# Altium schematic sheet STM32F4 Control Board.SchDoc
size 599 x 190 mm; SheetNumber: 1; SheetTotal: 1
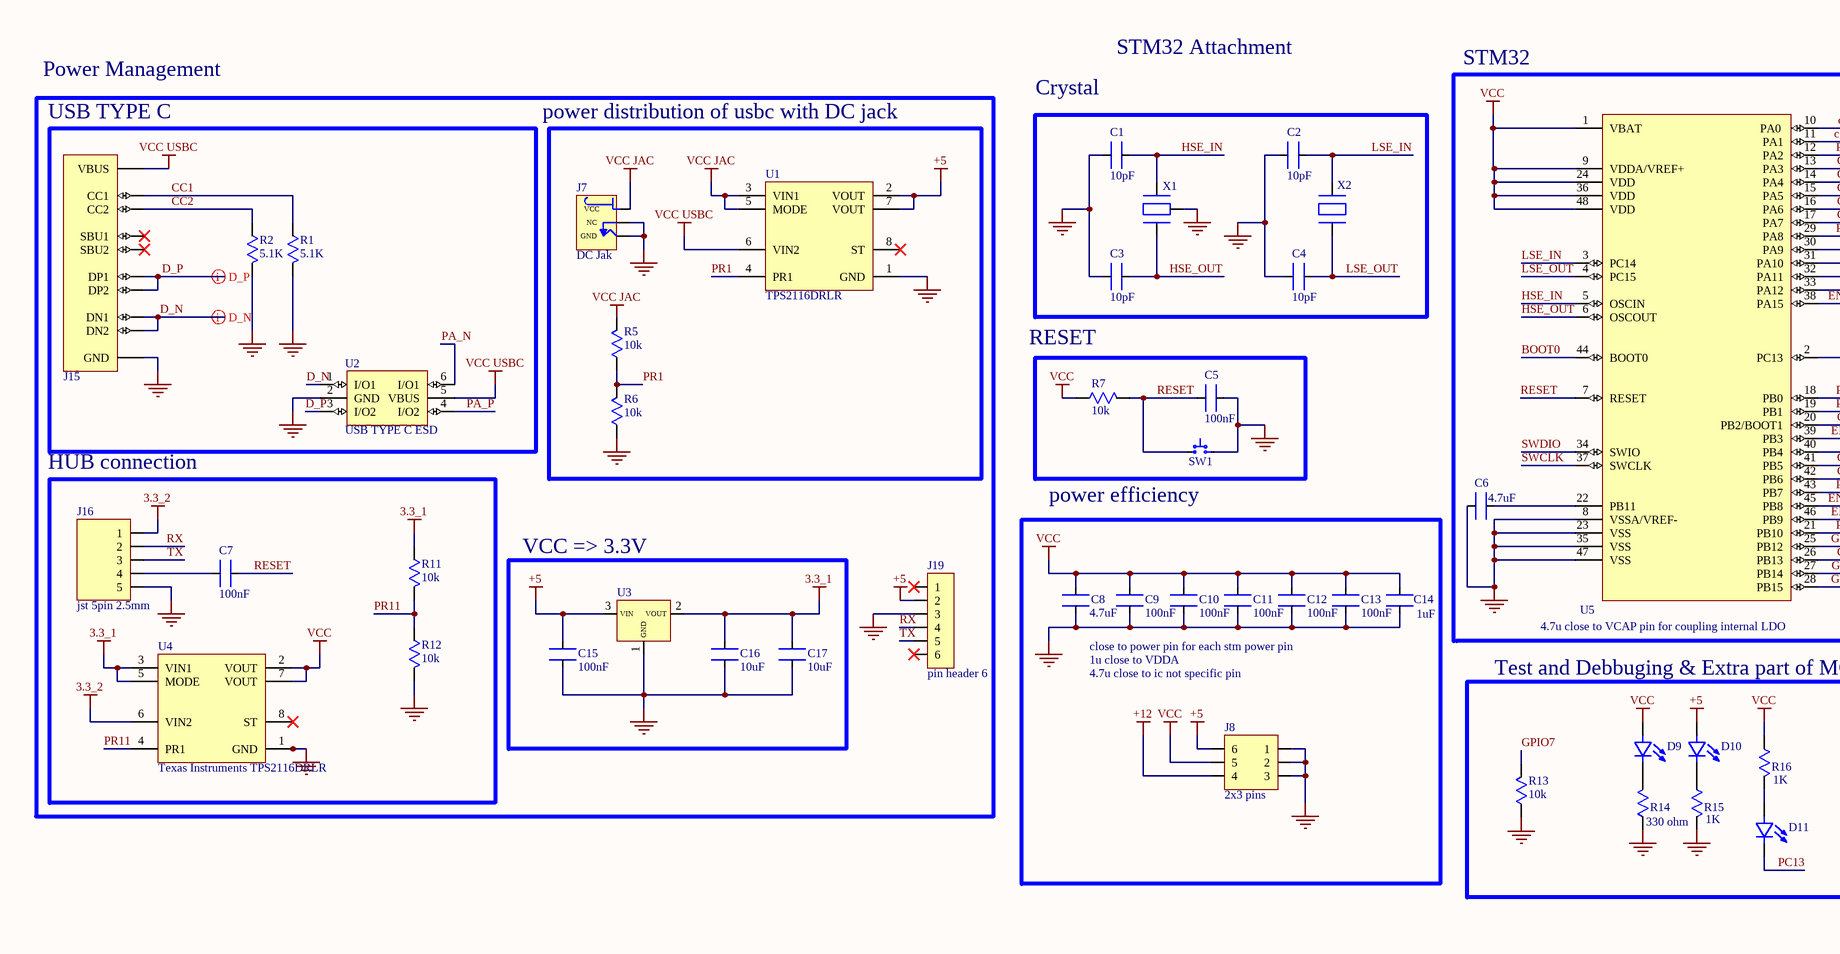
[diagram p0: STM32F4 Control Board.SchDoc, left]
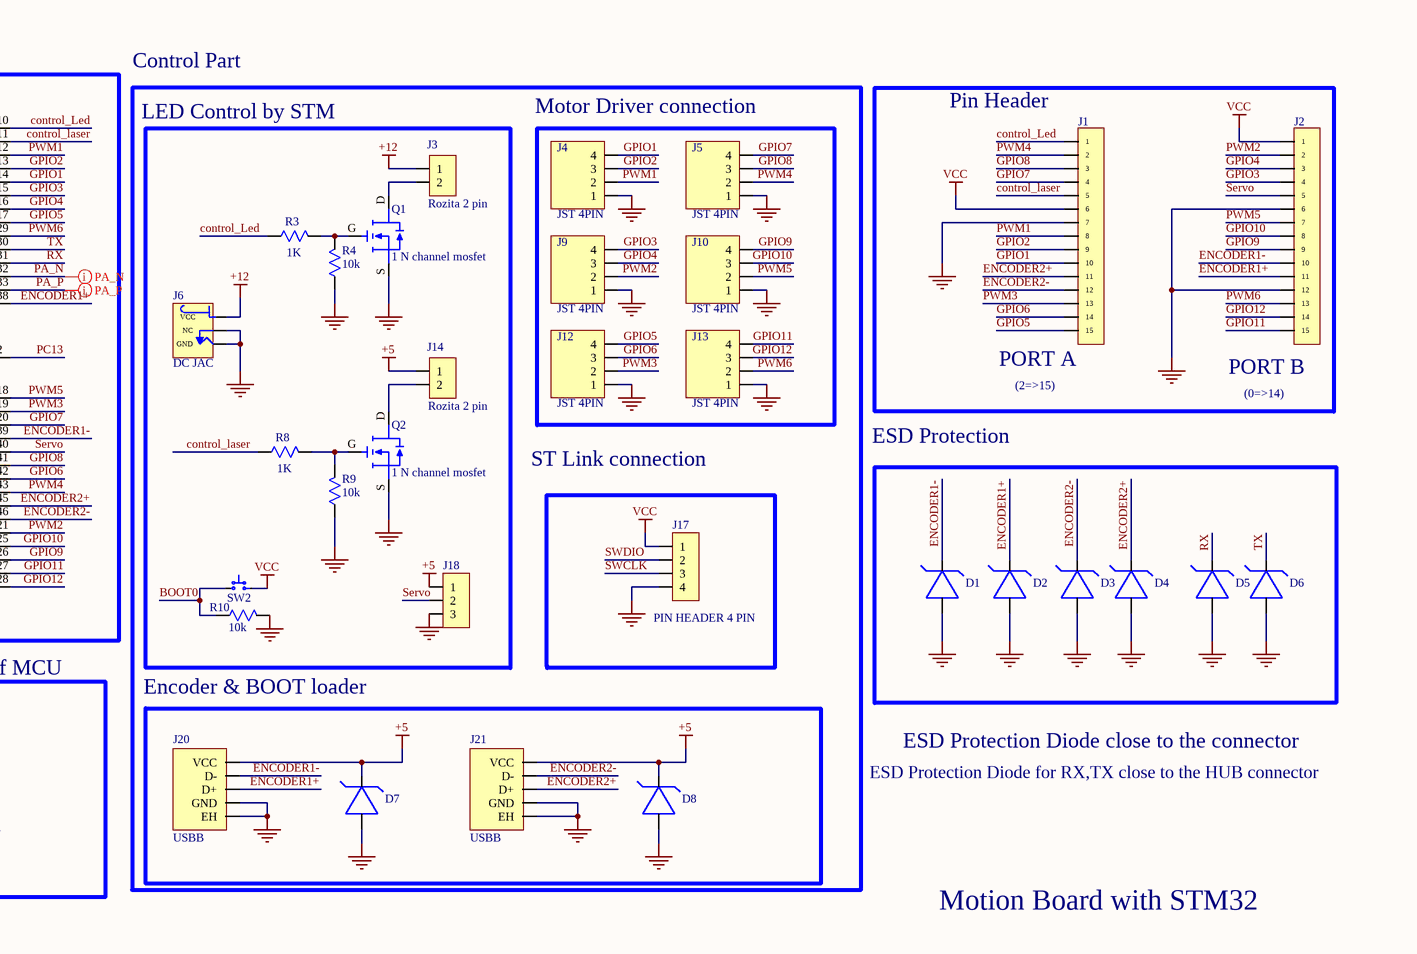
[diagram p1: STM32F4 Control Board.SchDoc, right]

## Parts
C1  10pF  [0603 CAP]
C2  10pF  [0603 CAP]
C3  10pF  [0603 CAP]
C4  10pF  [0603 CAP]
C5  100nF  [0603 CAP]
C6  4.7uF  [0603 CAP]
C7  100nF  [0603 CAP]
C8  4.7uF  [0603 CAP]
C9  100nF  [0603 CAP]
C10  100nF  [0603 CAP]
C11  100nF  [0603 CAP]
C12  100nF  [0603 CAP]
C13  100nF  [0603 CAP]
C14  1uF  [0603 CAP]
C15  100nF  [0603 CAP]
C16  10uF  [0603 CAP]
C17  10uF  [0603 CAP]
D1  ESD protection diode  [ESD protection diode]  (value not drawn)
D2  ESD protection diode  [ESD protection diode]  (value not drawn)
D3  ESD protection diode  [ESD protection diode]  (value not drawn)
D4  ESD protection diode  [ESD protection diode]  (value not drawn)
D5  ESD protection diode  [ESD protection diode]  (value not drawn)
D6  ESD protection diode  [ESD protection diode]  (value not drawn)
D7  ESD protection diode  [ESD protection diode]  (value not drawn)
D8  ESD protection diode  [ESD protection diode]  (value not drawn)
D9  RED led  [led 0805]  (value not drawn)
D10  RED led  [led 0805]  (value not drawn)
D11  RED led  [led 0805]  (value not drawn)
J1  pin header 15 pin  [pin headers 15 pin]  (value not drawn)
J2  pin header 15 pin  [pin headers 15 pin]  (value not drawn)
J3  Rozita 2 pin  [Rozita]
J4  JST 4PIN  [JST 4PIN]
J5  JST 4PIN  [JST 4PIN]
J6  DC JAC  [DC Jack]
J7  DC Jak  [DC Jack]
J8  2x3 pins  [2x3 pins]
J9  JST 4PIN  [JST 4PIN]
J10  JST 4PIN  [JST 4PIN]
J12  JST 4PIN  [JST 4PIN]
J13  JST 4PIN  [JST 4PIN]
J14  Rozita 2 pin  [Rozita]
J15  USB TYPE-C-31-M-12  [USB Type-C]  (value not drawn)
J16  jst 5pin 2.5mm  [JST 5 PIN 2.5 MM]
J17  PIN HEADER 4 PIN  [pin header 4PIN]
J18  Plugin,P=2.54mm  [pin header 3 pin]  (value not drawn)
J19  pin header 6  [pin header 6 pin]
J20  USBB  [USBB]
J21  USBB  [USBB]
Q1  1 N channel mosfet  [1 N channel mosfet]
Q2  1 N channel mosfet  [1 N channel mosfet]
R1  5.1K  [0603 RES]
R2  5.1K  [0603 RES]
R3  1K  [0603 RES]
R4  10k  [0603 RES]
R5  10k  [0603 RES]
R6  10k  [0603 RES]
R7  10k  [0603 RES]
R8  1K  [0603 RES]
R9  10k  [0603 RES]
R10  10k  [0603 RES]
R11  10k  [0603 RES]
R12  10k  [0603 RES]
R13  10k  [0603 RES]
R14  330 ohm  [0603 RES]
R15  1K  [0603 RES]
R16  1K  [0603 RES]
SW1  push button  [Push button]  (value not drawn)
SW2  push button  [Push button]  (value not drawn)
U1  TPS2116DRLR  [power distribution]
U2  USB TYPE C ESD  [usb c esd]
U3  ST LDO 3.3 regulator  [ST_LDO]  (value not drawn)
U4  Texas Instruments TPS2116DRLR  [power distribution]
U5  High-performance basic series ARM Cortex-M4 MCU with DSP and FPU, featuring 512 KB Flash, 100 MHz CPU, and ART accelerator  [Stm32 UFQFPN-48]  (value not drawn)
X1  Shenzhen SCTF Elec SX3B25.000F0810G30  [25MHZ Crystal Oscillators]  (value not drawn)
X2  Seiko Epson X1A0000610006  [32.768 KHZ Crystal oscillator]  (value not drawn)

## Blocks framed on the sheet
STM32: C6 U5
Crystal: C1-C4 X1 X2
USB TYPE C: J15 R1 R2 U2
Motor Driver connection: J4 J5 J9 J10 J12 J13
HUB connection: C7 J16 R11 R12 U4
power efficiency: C8-C14 J8
VCC => 3.3V: C15-C17 U3
Test and Debbuging & Extra part of MCU: D9-D11 R13-R16
Encoder & BOOT loader: D7 D8 J20 J21

## Nets
3.3_1: C16.1 C17.1 R11.2 U3.2(VOUT) U4.3(VIN1) U4.5(MODE)
3.3_2: J16.1 U4.6(VIN2)
+5: C15.2 D7.2 D8.2 D10.1 J8.6 J14.1 J18.1 J19.2 J20.1(VCC) J21.1(VCC) U1.2(VOUT) U1.7(VOUT) U3.3(VIN)
+12: J3.1 J6.1(VCC) J8.4
GND: C1.2 C2.2 C3.2 C4.2 C5.1 C6.2 C8.1 C9.2 C10.2 C11.2 C12.2 C13.2 C14.2 C15.1 C16.2 C17.2 D1.1 D2.1 D3.1 D4.1 D5.1 D6.1 D7.1 D8.1 J1.7 J2.6 J2.12 J4.1 J5.1 J6.2(GND) J6.3(NC) J7.2(GND) J7.3(NC) J8.1 J8.2 J8.3 J9.1 J10.1 J12.1 J13.1 J15.0(GND) J16.5 J17.4 J18.3 J19.3 J20.4(GND) J20.5(EH) J21.4(GND) J21.5(EH) Q1.S Q2.S R1.2 R2.2 R4.1 R6.1 R9.1 R10.2 R12.1 R13.1 R14.1 R15.2 SW1.2 U1.1(GND) U2.2(GND) U3.1(GND) U4.1(GND) U5.8(VSSA/VREF-) U5.23(VSS) U5.35(VSS) U5.47(VSS) X1.2(GND)
VCC: C8.2 C9.1 C10.1 C11.1 C12.1 C13.1 C14.1 D9.1 J1.6 J2.1 J8.5 J17.1 R7.1 R16.1 SW2.2 U4.2(VOUT) U4.7(VOUT) U5.1(VBAT) U5.9(VDDA/VREF+) U5.24(VDD) U5.36(VDD) U5.48(VDD)
VCC JAC: J7.1(VCC) R5.2 U1.3(VIN1) U1.5(MODE)
VCC USBC: J15.VBUS U1.6(VIN2) U2.5(VBUS)
BOOT0: R10.1 SW2.1 U5.44(BOOT0)
CC1: J15.A5(CC1) R1.1
CC2: J15.B5(CC2) R2.1
control_laser: J1.5 R8.1 U5.11(PA1)
control_Led: J1.1 R3.1 U5.10(PA0)
D_N: J15.A7(DN1) J15.B7(DN2) U2.1(I/O1)
D_P: J15.A6(DP1) J15.B6(DP2) U2.3(I/O2)
ENCODER1+: D2.2 J2.11 J20.3(D+) U5.38(PA15)
ENCODER1-: D1.2 J2.10 J20.2(D-) U5.39(PB3)
ENCODER2+: D4.2 J1.11 J21.3(D+) U5.45(PB8)
ENCODER2-: D3.2 J1.12 J21.2(D-) U5.46(PB9)
GPIO1: J1.10 J4.4 U5.14(PA4)
GPIO2: J1.9 J4.3 U5.13(PA3)
GPIO3: J2.4 J9.4 U5.15(PA5)
GPIO4: J2.3 J9.3 U5.16(PA6)
GPIO5: J1.15 J12.4 U5.17(PA7)
GPIO6: J1.14 J12.3 U5.42(PB6)
GPIO7: J1.4 J5.4 R13.2 U5.20(PB2/BOOT1)
GPIO8: J1.3 J5.3 U5.41(PB5)
GPIO9: J2.9 J10.4 U5.26(PB13)
GPIO10: J2.8 J10.3 U5.25(PB12)
GPIO11: J2.15 J13.4 U5.27(PB14)
GPIO12: J2.14 J13.3 U5.28(PB15)
HSE_IN: C1.1 U5.5(OSCIN) X1.1(OSC1)
HSE_OUT: C3.1 U5.6(OSCOUT) X1.3(OSC2)
LSE_IN: C2.1 U5.3(PC14) X2.1(OSC1)
LSE_OUT: C4.1 U5.4(PC15) X2.2(OSC2)
PA_N: U2.6(I/O1) U5.32(PA11)
PA_P: U2.4(I/O2) U5.33(PA12)
PC13: D11.2 U5.2(PC13)
PR1: R5.1 R6.2 U1.4(PR1)
PR11: R11.1 R12.2 U4.4(PR1)
PWM1: J1.8 J4.2 U5.12(PA2)
PWM2: J2.2 J9.2 U5.21(PB10)
PWM3: J1.13 J12.2 U5.19(PB1)
PWM4: J1.2 J5.2 U5.43(PB7)
PWM5: J2.7 J10.2 U5.18(PB0)
PWM6: J2.13 J13.2 U5.29(PA8)
RESET: C5.2 C7.2 R7.2 SW1.1 U5.7(RESET)
RX: D5.2 J16.2 J19.4 U5.31(PA10)
Servo: J2.5 J18.2 U5.40(PB4)
SWCLK: J17.3 U5.37(SWCLK)
SWDIO: J17.2 U5.34(SWIO)
TX: D6.2 J16.3 J19.5 U5.30(PA9)
NetC6_1: C6.1 U5.22(PB11)
NetC7_1: C7.1 J16.4
NetD9_2: D9.2 R14.2
NetD10_2: D10.2 R15.1
NetD11_1: D11.1 R16.2
NetJ3_2: J3.2 Q1.D
NetJ14_2: J14.2 Q2.D
NetQ1_G: Q1.G R3.2 R4.2
NetQ2_G: Q2.G R8.2 R9.2

Not connected (* = marked no-connect by the designer): J15 A8(SBU1)* B8(SBU2)*; J19 1* 6*; U1 8(ST)*; U4 8(ST)*

## Layout directives
differential pair: D_N, D_P, PA_N, PA_P

## Notes on the sheet
- Power Management
- STM32 Attachment
- Control Part
- power distribution of usbc with DC jack
- LED Control by STM
- (near J1) Pin Header
- RESET
- (near J1) PORT A
- (2=>15)
- (near J2) PORT B
- (0=>14)
- ST Link connection
- ESD Protection
- (near U5) 4.7u close to VCAP pin for coupling internal LDO
- close to power pin for each stm power pin
- 1u close to VDDA
- 4.7u close to ic not specific pin
- ESD Protection Diode close to the connector
- ESD Protection Diode for RX,TX close to the HUB connector
- Motion Board with STM32

## Library data of the parts
C1-C4 = 10pf: 50V 10pF NP0 ±5% 0603 Multilayer Ceramic Capacitors MLCC - SMD/SMT ROHS; Manufacture: YAGEO; Manufacture part number: CC0603JRNPO9BN100; Supplier: LCSC; Supplier part number: C106245; Link: https://www.lcsc.com/product-detail/Multilayer-Ceramic-Capacitors-MLCC-SMD-SMT_YAGEO-CC0603JRNPO9BN100_C106245.html
C5 C7 C9-C13 C15 = 100nF: 50V 100nF X7R ±10% 0603 Multilayer Ceramic Capacitors MLCC - SMD/SMT ROHS; Manufacture: YAGEO; Manufacture part number: CC0603KRX7R9BB104; Supplier: LCSC; Supplier part number: C14663; Link: https://www.lcsc.com/product-detail/Multilayer-Ceramic-Capacitors-MLCC-SMD-SMT_YAGEO-CC0603KRX7R9BB104_C14663.html
C6 C8 = 4.7uF: 6.3V 4.7uF X5R ±20% 0603 Multilayer Ceramic Capacitors MLCC - SMD/SMT ROHS; Manufacture: Samsung Electro-Mechanics; Manufacture part number: CL10A475MQ8NNNC; Supplier: LCSC; Supplier part number: C154959; Link: https://www.lcsc.com/product-detail/Multilayer-Ceramic-Capacitors-MLCC-SMD-SMT_Samsung-Electro-Mechanics-CL10A475MQ8NNNC_C154959.html?s_z=n_6.3V%25204.7uF%2520X5R%2520%25C2%25B120%2525%25200603%2520Multilayer%2520Ceramic%2520Capacitors%2520MLCC%2520-%2520SMD%252FSMT%2520ROHS
C14 = 1uF: 16V 1uF X5R ±10% 0603 Multilayer Ceramic Capacitors MLCC - SMD/SMT ROHS; Manufacture: HRE; Manufacture part number: CGA0603X5R105K160JT; Supplier: LCSC; Supplier part number: C6119849; Link: https://www.lcsc.com/product-detail/Multilayer-Ceramic-Capacitors-MLCC-SMD-SMT_HRE-CGA0603X5R105K160JT_C6119849.html
C16 C17 = 10uF: 6.3V 10uF X5R ±20% 0603 Multilayer Ceramic Capacitors MLCC - SMD/SMT ROHS; Manufacture: YAGEO; Manufacture part number: CC0603MRX5R5BB106; Supplier: LCSC; Supplier part number: C109454; Link: https://www.lcsc.com/product-detail/Multilayer-Ceramic-Capacitors-MLCC-SMD-SMT_YAGEO-CC0603MRX5R5BB106_C109454.html
D1-D8 = ESD protection diode: SOT-5X3 ESD and Surge Protection (TVS/ESD) ROHS; Manufacture: Texas Instruments; Manufacture part number: ESD321DYAR; Supplier: LCSC; Supplier part number: C20345394; Link: https://www.lcsc.com/product-detail/ESD-and-Surge-Protection-TVS-ESD_Texas-Instruments-ESD321DYAR_C20345394.html
D9-D11 = RED LED: 20mA 8mcd Colorless Transparent Lens 617nm Red 2V 0805 LED Indication - Discrete ROHS; Manufacture: Kingbright; Manufacture part number: APT2012EC; Supplier: LCSC; Supplier part number: C5879378; Link: https://www.lcsc.com/product-detail/LED-Indication-Discrete_Kingbright-APT2012EC_C5879378.html
J1 J2 = pin header 15 pin: Gold 1kV 3A Straight Policy 2.5mm 6mm 15P -40℃~+105℃ 3mm 2.54mm Brass Black Single Row 1x15P Plugin,P=2.54mm Pin Headers ROHS; Manufacture: Megastar; Manufacture part number: ZX-PZ2.54-1-15PZZ; Supplier: LCSC; Supplier part number: C7501269; Link: https://www.lcsc.com/product-detail/Pin-Headers_Megastar-ZX-PZ2-54-1-15PZZ_C7501269.html?s_z=n_pin%2520hea
J3 J14 = Rozita 2 pin: 1x2P 18A -40℃~+105℃ 250V Green 12~30 Direct Insert 5.08mm 2.5 1 2 Plugin,P=5.08mm Screw Terminal Blocks ROHS; Manufacture: DORABO; Manufacture part number: DB128L-5.08-2P-GN-S; Supplier: LCSC; Supplier part number: C395868; Link: https://www.lcsc.com/product-detail/Screw-Terminal-Blocks_DORABO-DB128L-5-08-2P-GN-S_C395868.html
J4 J5 J9 J10 J12 J13 = JST 4PIN: 1x4P 4P XH Tin 4 -25℃~+85℃ 3A 1 2.5mm Copper Direct Insert Plugin,P=2.5mm Wire To Board Connector ROHS; Manufacture: Hong Cheng; Manufacture part number: HC-XH-4A-TW; Supplier: LCSC; Supplier part number: C19273766; Link: https://www.lcsc.com/product-detail/Wire-To-Board-Connector_Hong-Cheng-HC-XH-4A-TW_C19273766.html?s_z=n_C19273766
J6 J7 = DC Jak: Bend-in DC Power Receptacle -20℃~+70℃ 2.5mm 6.5mm 5A 24V Plugin DC Power Connectors ROHS; Manufacture: XKB Connection; Manufacture part number: DC-005-5A-2.5; Supplier: LCSC; Supplier part number: C381115; Link: https://www.lcsc.com/product-detail/DC-Power-Connectors_XKB-Connection-DC-005-5A-2-5_C381115.html?s_z=n_DC%2520Power%2520Receptacle%25202.5mm%25206.4mm%25205A%2520%2520Plugin%2520DC%2520Power%2520Connectors%2520ROHS
J8 = 2x3 pins: Straight 2.54mm 6mm 6P 3mm 2.54mm 双排 2x3P Plugin,P=2.54mm Pin Headers ROHS; Manufacturer: HanElectricity; Mfr. Part #: 2541WV-2x03P; supplier: LCSC; LCSC Part #: C5383104
J15 = USB TYPE-C-31-M-12: 5A 1 16P Female Type-C SMD USB Connectors ROHS; Manufacture: Korean Hroparts Elec; Supplier: LCSC; Supplier part number: C165948; Manufacture part number: TYPE-C-31-M-12; Link: https://www.lcsc.com/product-detail/USB-Connectors_Korean-Hroparts-Elec-TYPE-C-31-M-12_C165948.html
J16 = jst 5pin 2.5mm: 1x5P 5P XH Tin 5 -25℃~+85℃ 3A 1 2.5mm Brass Direct Insert Plugin,P=2.5mm Wire To Board Connector ROHS; Manufacture part number: B5B-XH-A(LF)(SN); Supplier: LCSC; Supplier part number: C157991; Manufacture: JST; Link: https://www.lcsc.com/product-detail/Wire-To-Board-Connector_JST-B5B-XH-A-LF-SN_C157991.html
J17 = PIN HEADER 4 PIN: 3A Policy 2.5mm 6mm 4P -40℃~+105℃ 2.54mm Single Row 1x4P Plugin,P=2.54mm Pin Headers ROHS; Manufacture: BXCONN; Manufacture part number: A254UP-ZD04P; Supplier: LCSC; Supplier part number: C41413833; Link: https://www.lcsc.com/product-detail/Pin-Headers_BXCONN-A254UP-ZD04P_C41413833.html
J18 = Pin Header 3pin: 3A Straight 3P -65℃~+125℃ 2.54mm Black Single Row Phosphor Bronze Plugin,P=2.54mm Pin Headers ROHS; Manufacture: Amphenol ICC; Manufacture part number: 68001-203HLF; Supplier: LCSC; Supplier part number: C5346215; Link: https://www.lcsc.com/product-detail/Pin-Headers_Amphenol-ICC-68001-203HLF_C5346215.html?s_z=n_Pin%2520Header%25201x3%2520TH%2520Pitch%25202.54mm
J19 = pin header 6: Straight Policy 2.5mm 6P 6mm -40℃~+105℃ 3mm 2.54mm Single Row Black Brass 1x6P Plugin,P=2.54mm Pin Headers ROHS; Manufacture: XFCN; Manufacture part number: PZ254V-11-06P; Supplier: LCSC; Supplier part number: C492405; Link: https://www.lcsc.com/product-detail/Pin-Headers_XFCN-PZ254V-11-06P_C492405.html?s_z=n_Connectors%257CPin%2520Headers
J20 J21 = USBB R04P-F000: USB 2.0 1 4P Female Type-B Plugin USB Connectors ROHS; Manufacture: Ckmtw(Shenzhen Cankemeng); Manufacture part number: U-USBBR04P-F000; Supplier: lcsc; Supplier part number: C189733; Link: https://www.lcsc.com/product-detail/USB-Connectors_Ckmtw-Shenzhen-Cankemeng-U-USBBR04P-F000_C189733.html?s_z=n_usbb
Q1 Q2 = 1 N channel mosfet: 20V 7A 1.25W 10mΩ@4.5V,7A 500mV 1 N-channel SOT-23-3L MOSFETs ROHS; Manufacture: Siliup; Manufacture part number: SP20N09T1; Supplier: LCSC; Supplier part number: C41354900; Link: https://www.lcsc.com/product-detail/MOSFETs_Siliup-SP20N09T1_C41354900.html
R1 R2 = RES 5.1 K: 100mW Thin Film Resistor 75V ±25ppm/℃ ±0.1% 5.1kΩ 0603 Chip Resistor - Surface Mount ROHS; Manufacture: YAGEO; Manufacture part number: RT0603BRD075K1L; Supplier: LCSC; Supplier part number: C122969; Link: https://www.lcsc.com/product-detail/Chip-Resistor-Surface-Mount_YAGEO-RT0603BRD075K1L_C122969.html
R3 R8 R15 R16 = RES 1K ohm: 100mW Thick Film Resistors 75V ±100ppm/℃ ±5% 1kΩ 0603 Chip Resistor - Surface Mount ROHS; Manufacture: FOJAN; Manufacture part number: FRC0603J102 TS; Supplier: LCSC; Supplier part number: C2907113; Link: https://www.lcsc.com/product-detail/Chip-Resistor-Surface-Mount_FOJAN-FRC0603J102-TS_C2907113.html
R4-R7 R9-R13 = RES 10kohm: 100mW Thin Film Resistor 75V ±25ppm/℃ ±0.1% 10kΩ 0603 Chip Resistor - Surface Mount ROHS; Manufacture: YAGEO; Manufacture part number: RT0603BRD0710KL; Supplier: LCSC; Supplier part number: C95204; Link: https://www.lcsc.com/product-detail/Chip-Resistor-Surface-Mount_YAGEO-RT0603BRD0710KL_C95204.html?s_z=n_100mW%2520Thin%2520Film%2520Resistor%252075V%2520%25C2%25B125ppm%252F%25E2%2584%2583%2520%25C2%25B10.1%2525%252010k%25CE%25A9%25200603%2520Chip%2520Resistor%2520-%2520Surface%2520Mount%2520ROHS
R14 = RES 330 ohm: 100mW Thick Film Resistors 75V ±100ppm/℃ ±5% 330Ω 0603 Chip Resistor - Surface Mount ROHS; Manufacture: FOJAN; Manufacture part number: FRC0603J331 TS; Supplier: LCSC; Supplier part number: C2907152; Link: https://www.lcsc.com/product-detail/Chip-Resistor-Surface-Mount_FOJAN-FRC0603J331-TS_C2907152.html
SW1 SW2 = push button: None Without bracket 50mA 6.1mm 30,000 Times 250gf 12V 3.7mm 2.5mm Rectangle button Standing paste SPST SMD,3.7x6.1mm Tactile Switches ROHS; Manufacture: HYP (Hongyuan Precision); Manufacture part number: 1TS002E-2500-2500-CT; Supplier: LCSC; Supplier part number: C329185; Link: https://www.lcsc.com/product-detail/Tactile-Switches_HYP-Hongyuan-Precision-1TS002E-2500-2500-CT_C329185.html
U1 = power distribution: 1.6V~5.5V 42mΩ 2.5A 1 SOT-583 Power Distribution Switches ROHS; Manufacture: Texas Instruments; Supplier: LCSC; Supplier part number: C3235557; Manufacture part number: TPS2116DRLR; Link: https://www.lcsc.com/product-detail/Power-Distribution-Switches_Texas-Instruments-TPS2116DRLR_C3235557.html
U2 = usb tybc esd: SOT-23-6 ESD and Surge Protection (TVS/ESD) ROHS; Manufacture: TECH PUBLIC; Manufacture part number: TPUSBLC6-2SC6; Supplier: LCSC; Supplier part number: C558442; Link: https://www.lcsc.com/product-detail/ESD-and-Surge-Protection-TVS-ESD_TECH-PUBLIC-TPUSBLC6-2SC6_C558442.html
U3 = ST LDO 3.3 regulator: 1A Fixed 3.3V Positive electrode 15V SOT-223-4 Voltage Regulators - Linear, Low Drop Out (LDO) Regulators ROHS; Manufacture: STMicroelectronics; Manufacture part number: LD1117AS33TR; Supplier: LCSC; Supplier part number: C115288; Link: https://www.lcsc.com/product-detail/Voltage-Regulators-Linear-Low-Drop-Out-LDO-Regulators_STMicroelectronics-LD1117AS33TR_C115288.html
U4 = power distribution: 1.6V~5.5V 42mΩ 2.5A 1 SOT-583 Power Distribution Switches ROHS; Supplier: LCSC; Supplier part number: C3235557; Manufacture: Texas Instruments; Manufacture part number: TPS2116DRLR; Link: https://www.lcsc.com/product-detail/Power-Distribution-Switches_Texas-Instruments-TPS2116DRLR_C3235557.html
U5 = STMicroelectronics STM32F411CEU6: ARM-M4 100MHz UFQFPN-48(7x7) Microcontrollers (MCU/MPU/SOC) ROHS; Supplier: LCSC; Supplier part numberSupplier part number: C60420; Manufacture: STMicroelectronics; Manufacture  part number: STM32F411CEU6; Link: https://www.lcsc.com/product-detail/Microcontrollers-MCU-MPU-SOC_STMicroelectronics-STM32F411CEU6_C60420.html?s_z=n_STM32F411CEU6
X1 = 25MHZ Crystal oscillator: 25MHz Surface Mount Crystal 8pF ±10ppm ±30ppm SMD3225-4P Crystals ROHS; Supplier: LCSC; Supplier part number: C7302032; Manufacture: Shenzhen SCTF Elec; Manufacture part number: SX3B25.000F0810G30; Link: https://www.lcsc.com/product-detail/Crystals_Shenzhen-SCTF-Elec-SX3B25-000F0810G30_C7302032.html
X2 = 32.768 KHZ Crystal oscillator: 32.768kHz Surface Mount Crystal 7pF ±20ppm SMD2012-2P Crystals ROHSS.; Supplier: LCSC; Supplier part number: C99009; Manufacture: Seiko Epson; Manufacture part number: X1A0000610006; Link: https://www.lcsc.com/product-detail/Crystals_Seiko-Epson-X1A0000610006_C99009.html